# Altium schematic sheet J_SD_KEYPAD.SchDoc
size 420 x 297 mm; Organization: Altium Limited; Address1: L3, 12a Rodborough Rd; Address2: Frenchs Forest; Address3: NSW; Address4: Australia 2086
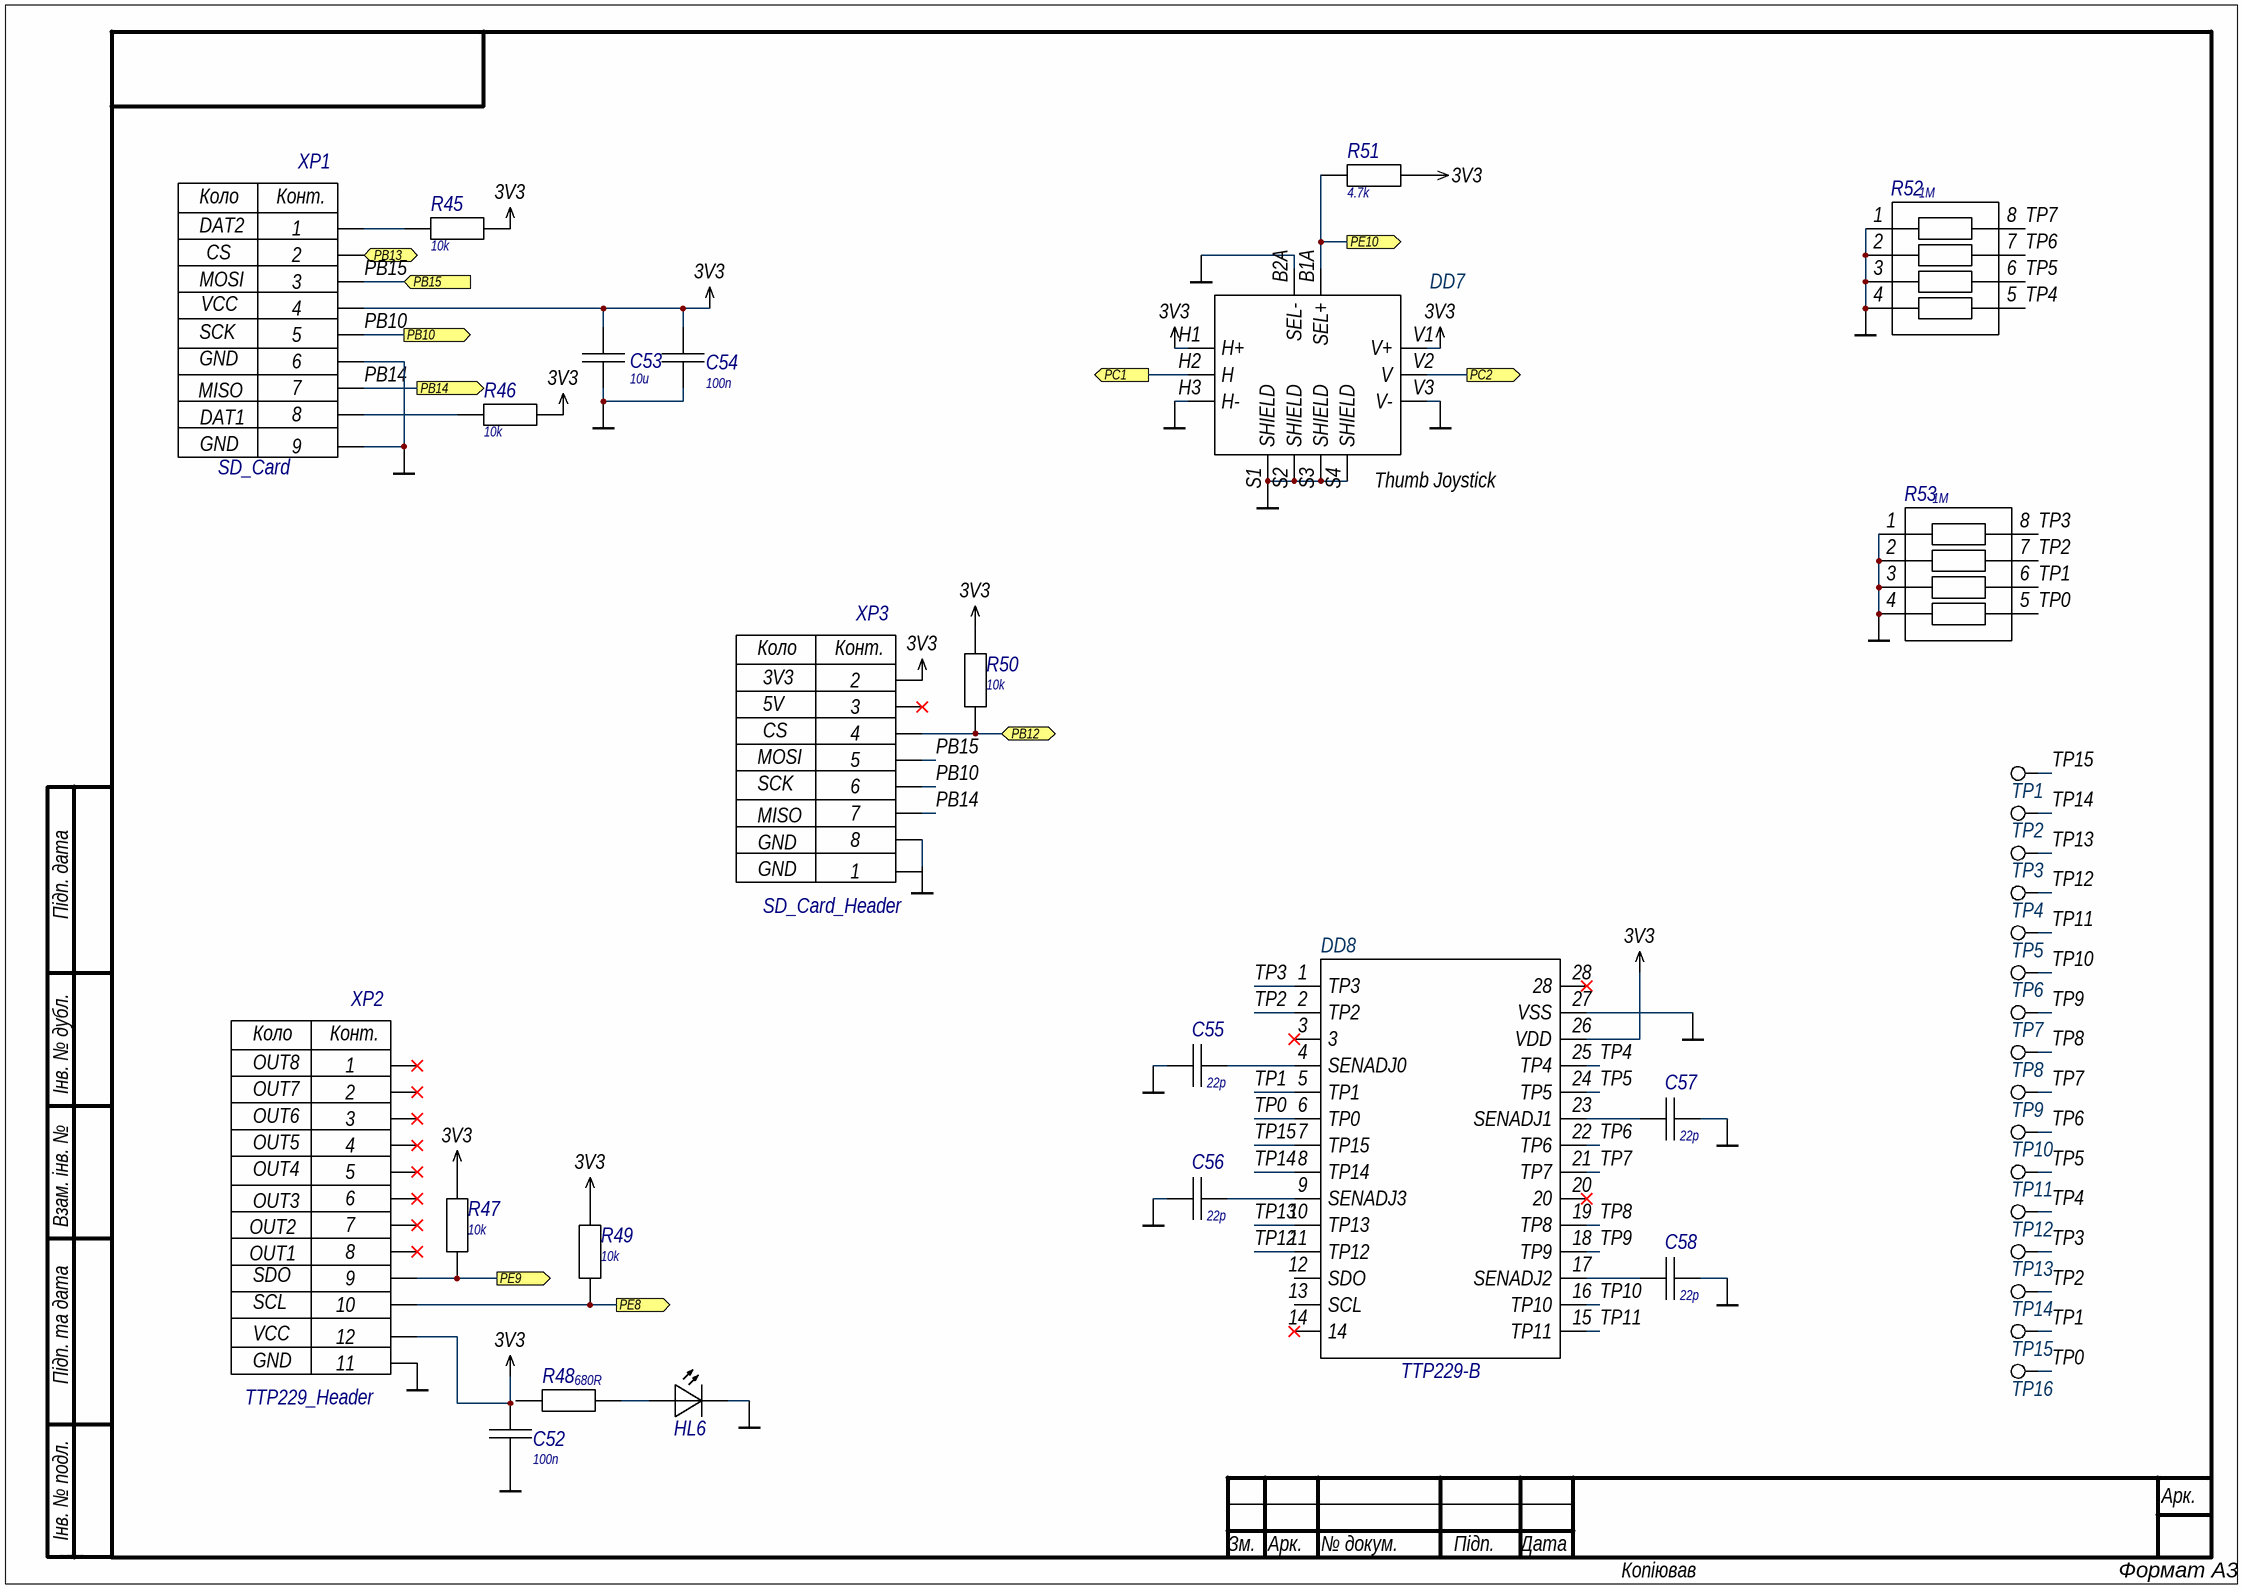
[diagram p0: J_SD_KEYPAD.SchDoc]

## Parts
C52  value 100n  [C_0603]
C53  value 10u  [C_0603]
C54  value 100n  [C_0603]
C55  value 22p  [C_0603]
C56  value 22p  [C_0603]
C57  value 22p  [C_0603]
C58  value 22p  [C_0603]
DD7  Thumb Joystick  [XDCR_COM-09032]
DD8  CP2102-GM  [28-SSOP]  (value not drawn)
HL6  (no value)  [LED]
R45  value 10k  [R0_0603]  (hidden comment: 0603 0 В 10k 1% Keystone Electronics)
R46  value 10k  [R0_0603]  (hidden comment: 0603 0 В 10k 1% Keystone Electronics)
R47  value 10k  [R0_0603]  (hidden comment: 0603 0 В 10k 1% Keystone Electronics)
R48  value 680R  [R0_0603]  (hidden comment: 0603 0 В 680R 1% Keystone Electronics)
R49  value 10k  [R0_0603]  (hidden comment: 0603 0 В 10k 1% Keystone Electronics)
R50  value 10k  [R0_0603]  (hidden comment: 0603 0 В 10k 1% Keystone Electronics)
R51  value 4.7k  [R0_0603]  (hidden comment: 0603 0 В 4.7k 1% Keystone Electronics)
R52  value 1M  [RESISTOR_NETWORKS]  (hidden comment: 0603 0 В 1M 1% Keystone Electronics)
R53  value 1M  [RESISTOR_NETWORKS]  (hidden comment: 0603 0 В 1M 1% Keystone Electronics)
TP1  TP  [PAD-1.25mm]  (value not drawn)  (no BOM)
TP2  TP  [PAD-1.25mm]  (value not drawn)  (no BOM)
TP3  TP  [PAD-1.25mm]  (value not drawn)  (no BOM)
TP4  TP  [PAD-1.25mm]  (value not drawn)  (no BOM)
TP5  TP  [PAD-1.25mm]  (value not drawn)  (no BOM)
TP6  TP  [PAD-1.25mm]  (value not drawn)  (no BOM)
TP7  TP  [PAD-1.25mm]  (value not drawn)  (no BOM)
TP8  TP  [PAD-1.25mm]  (value not drawn)  (no BOM)
TP9  TP  [PAD-1.25mm]  (value not drawn)  (no BOM)
TP10  TP  [PAD-1.25mm]  (value not drawn)  (no BOM)
TP11  TP  [PAD-1.25mm]  (value not drawn)  (no BOM)
TP12  TP  [PAD-1.25mm]  (value not drawn)  (no BOM)
TP13  TP  [PAD-1.25mm]  (value not drawn)  (no BOM)
TP14  TP  [PAD-1.25mm]  (value not drawn)  (no BOM)
TP15  TP  [PAD-1.25mm]  (value not drawn)  (no BOM)
TP16  TP  [PAD-1.25mm]  (value not drawn)  (no BOM)
XP1  SD_Card  [xp9]
XP2  TTP229_Header  [xp12]
XP3  SD_Card_Header  [xp8]

## Ports
PB10 (out), PB12 (bidir), PB13 (bidir), PB14 (out), PB15 (in), PC1 (out), PC2 (out), PE8 (out), PE9 (out), PE10 (out)

## Nets
3V3: C52.1 C53.2 C54.2 DD7.H1(H+) DD7.V1(V+) DD8.26(VDD) R45.2 R46.2 R47.2 R49.2 R50.2 R51.2 XP1.4 XP2.12 XP3.2
GND: C52.2 C53.1 C54.1 C55.1 C56.1 C57.2 C58.2 DD7.B2A(SEL-) DD7.H3(H-) DD7.S1(SHIELD) DD7.S2(SHIELD) DD7.S3(SHIELD) DD7.S4(SHIELD) DD7.V3(V-) DD8.27(VSS) HL6.2 R52.1 R52.2 R52.3 R52.4 R53.1 R53.2 R53.3 R53.4 XP1.6 XP1.9 XP2.11 XP3.8
PB10: XP1.5 XP3.6 ; port PB10
PB12: R50.1 XP3.4 ; port PB12
PB13: XP1.2 ; port PB13
PB14: XP1.7 XP3.7 ; port PB14
PB15: XP1.3 XP3.5 ; port PB15
PC1: DD7.H2(H) ; port PC1
PC2: DD7.V2(V) ; port PC2
PE8: R49.1 XP2.10 ; port PE8
PE9: R47.1 XP2.9 ; port PE9
PE10: DD7.B1A(SEL+) R51.1 ; port PE10
TP0: DD8.6(TP0) R53.5 TP16.1
TP1: DD8.5(TP1) R53.6 TP15.1
TP2: DD8.2(TP2) R53.7 TP14.1
TP3: DD8.1(TP3) R53.8 TP13.1
TP4: DD8.25(TP4) R52.5 TP12.1
TP5: DD8.24(TP5) R52.6 TP11.1
TP6: DD8.22(TP6) R52.7 TP10.1
TP7: DD8.21(TP7) R52.8 TP9.1
TP8: DD8.19(TP8) TP8.1
TP9: DD8.18(TP9) TP7.1
TP10: DD8.16(TP10) TP6.1
TP11: DD8.15(TP11) TP5.1
TP12: DD8.11(TP12) TP4.1
TP13: DD8.10(TP13) TP3.1
TP14: DD8.8(TP14) TP2.1
TP15: DD8.7(TP15) TP1.1
NetC55_2: C55.2 DD8.4(SENADJ0)
NetC56_2: C56.2 DD8.9(SENADJ3)
NetC57_1: C57.1 DD8.23(SENADJ1)
NetC58_1: C58.1 DD8.17(SENADJ2)
NetHL6_1: HL6.1 R48.2
NetR45_1: R45.1 XP1.1
NetR46_1: R46.1 XP1.8

Not connected (* = marked no-connect by the designer): DD8 3* 12(SDO) 13(SCL) 14* 20* 28*; R48 1; XP2 1* 2* 3* 4* 5* 6* 7* 8*; XP3 1 3*

## Notes on the sheet
- Підп. дата
- Інв. № дубл.
- Взам. інв. №
- Підп. та дата
- Інв. № подл.
- Зм.
- Арк.
- № докум.
- Підп.
- Дата
- ALTIUM GOSTBOM2.0 KEV
- Копіював
- Формат А3
- (in symbol 8_PIN_HEADER) Коло; Конт.; 3V3; 5V; CS; MOSI; SCK; MISO; GND
- (in symbol 9_PIN_HEADER) Коло; Конт.; DAT2; CS; MOSI; VCC; SCK; GND; MISO; DAT1
- (in symbol 12_PIN_HEADER) Коло; Конт.; OUT8; OUT7; OUT6; OUT5; OUT4; OUT3; OUT2; OUT1; SDO; SCL; VCC; GND

## Library data of the parts
C52-C58 = C_0603: Manufacturer: TDK Corporation; Temp_Coef: X7R; Voltage: 50 В; Tolerance: 10%; Package: 0603
DD7 = COM-09032: Thumb Joystick, 1568-09032-ND; Manufacturer: SparkFun Electronics; Availability: Unavailable; Part Number: COM-09032
DD8 = TTP229-B: Manufacturer: Tontek Design Technology; Package: 28-SSOP; Part Number: TTP229-B
HL6 = LED: Manufacturer: Cree LED; Name: XPEBFR-LS-0000-00A01
R45-R51 = R_0603: Power: 0 В; Package: 0603; Tolerance: 1%; Manufacturer: Keystone Electronics
R52 R53 = RESISTOR_NETWORKS: Power: 0 В; Package: 0603; Tolerance: 1%; Manufacturer: Keystone Electronics
TP1-TP16 = TP: Test point 1.25mm. THT
XP1 = 9_PIN_HEADER: 475900001; Manufacturer: Samtec Inc.; Name: TS-111-T-AA
XP2 = 12_PIN_HEADER: Manufacturer: Samtec Inc.; Name: TS-111-T-AA
XP3 = 8_PIN_HEADER: 475900001; Manufacturer: Samtec Inc.; Name: TS-111-T-AA